# Altium schematic sheet SNC8600.SchDoc: 1234
size A2
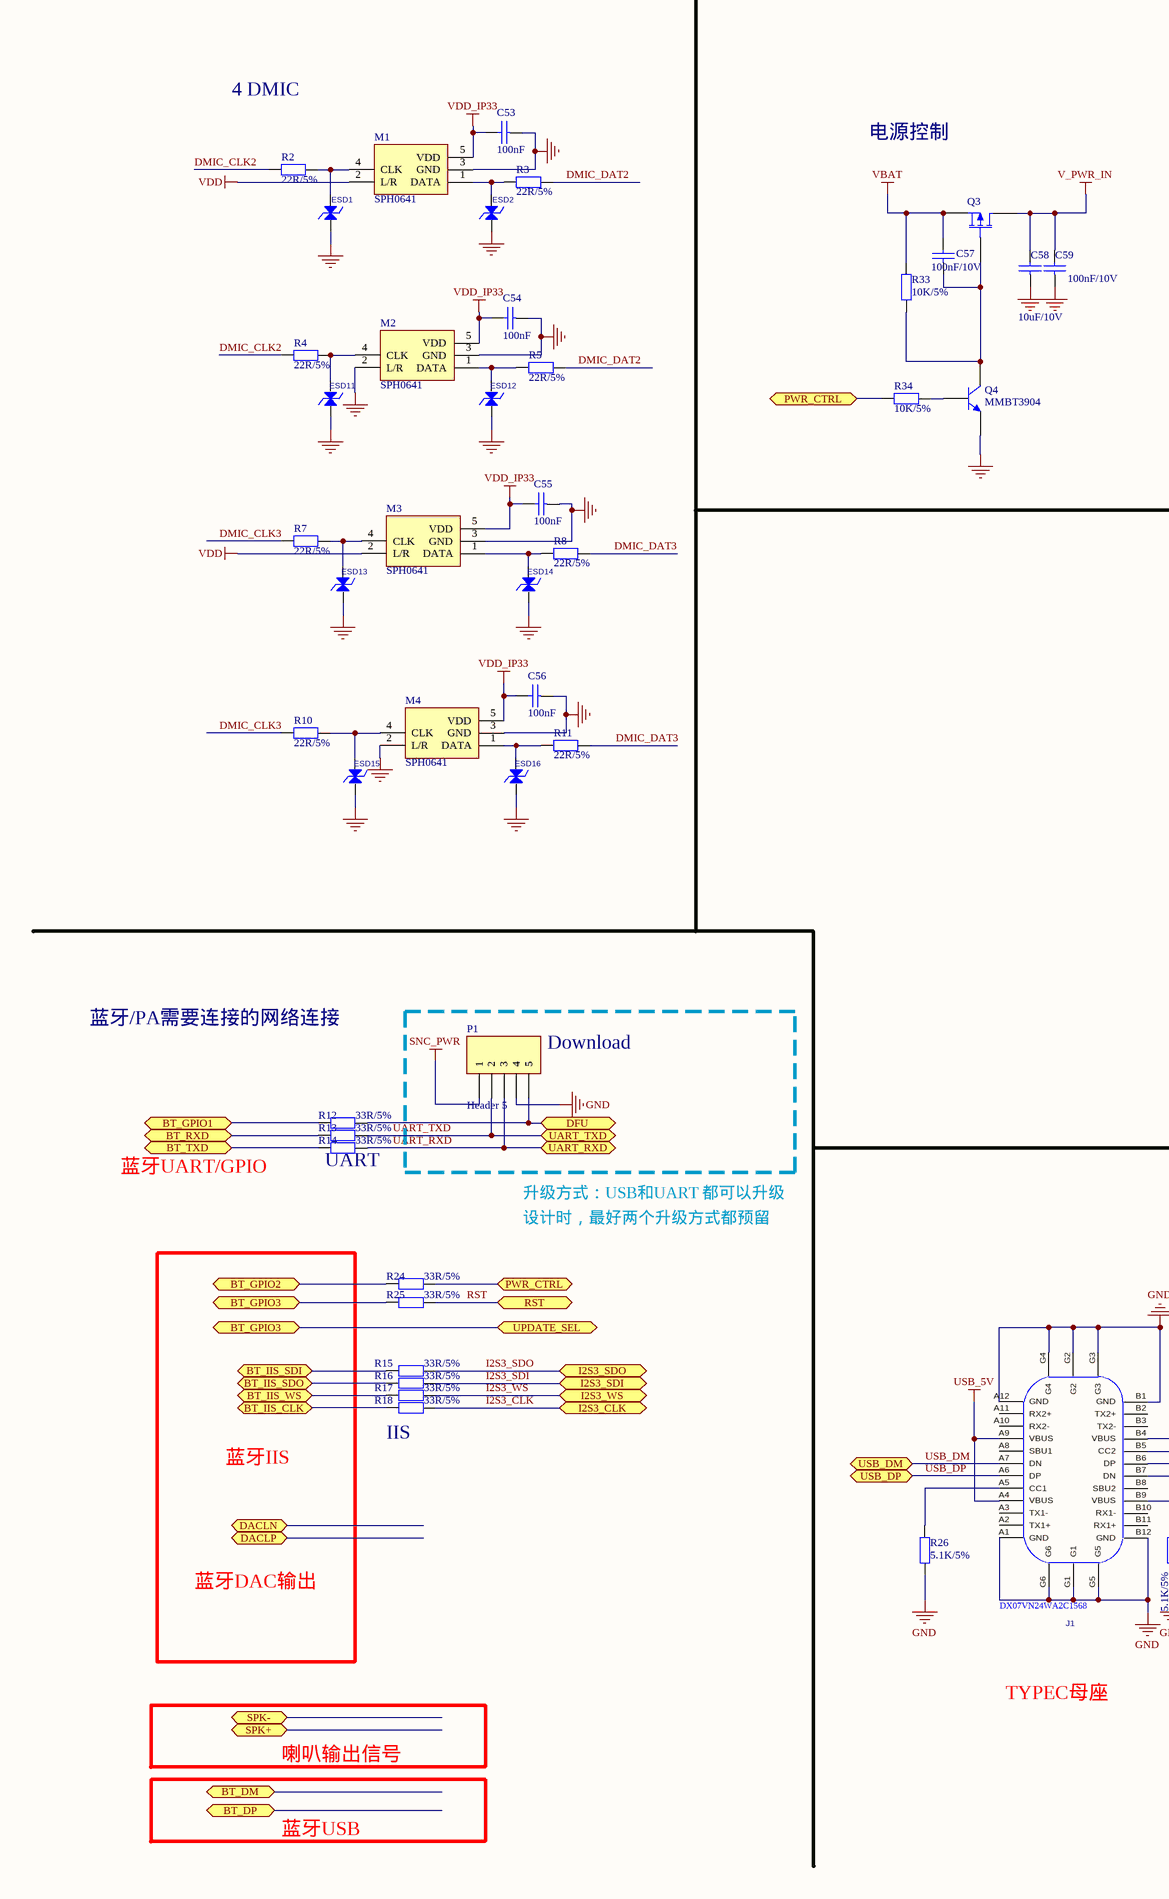
[diagram p0: SNC8600.SchDoc, left]
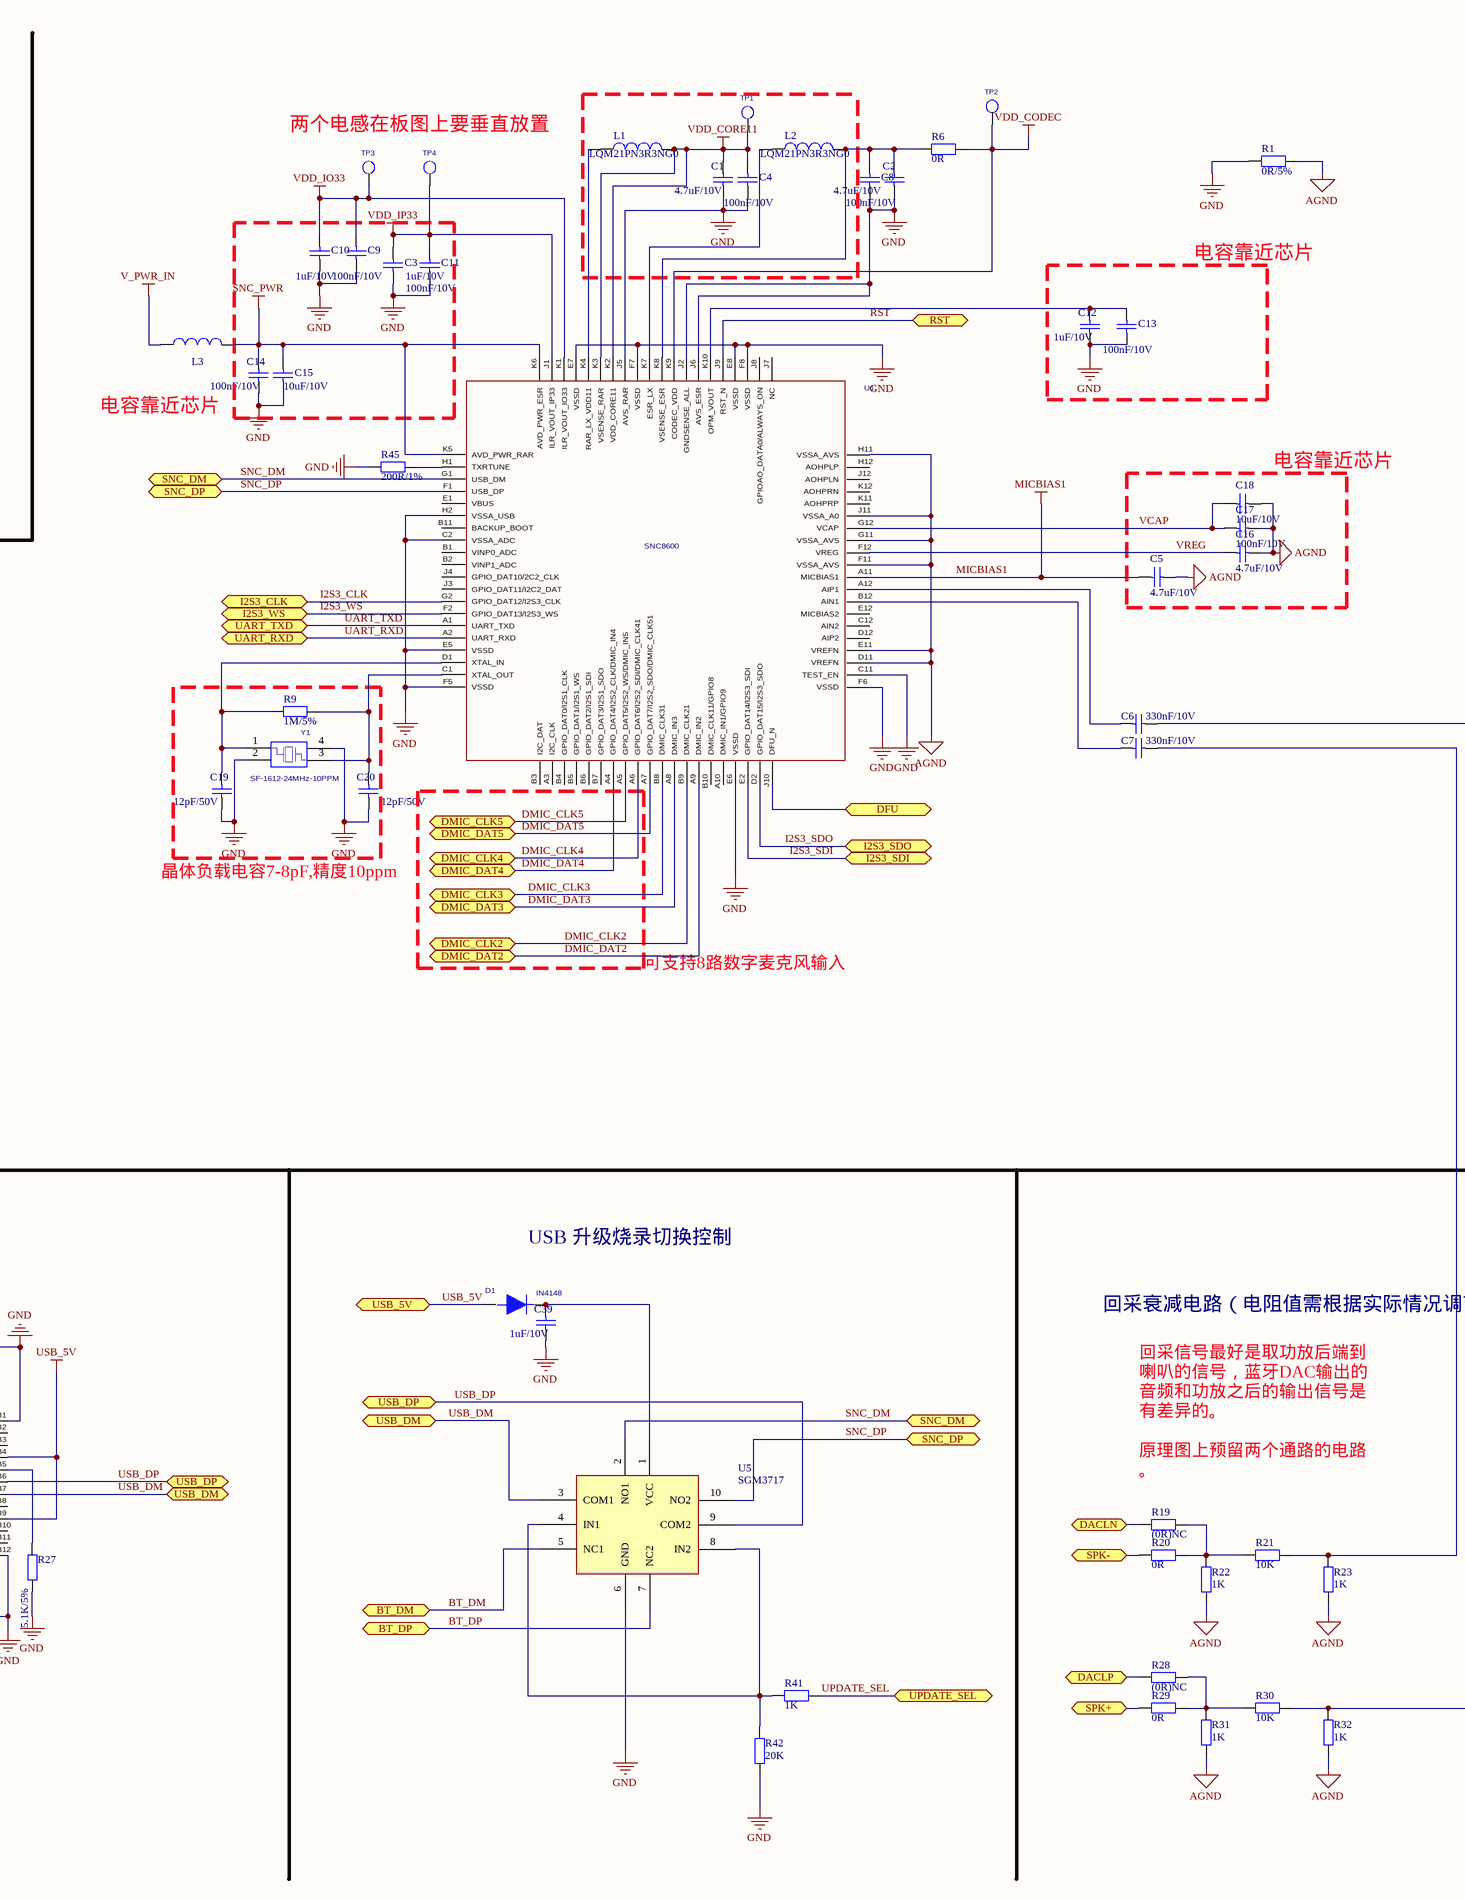
[diagram p1: SNC8600.SchDoc, right]

## Parts
C1  4.7uF/10V  [C0603]
C2  4.7uF/10V  [C0603]
C3  1uF/10V  [C0603]
C4  100nF/10V  [C0603]
C5  4.7uF/10V  [C0603]
C6  330nF/10V  [C0603]
C7  330nF/10V  [C0603]
C8  100nF/10V  [C0603]
C9  100nF/10V  [C0603]
C10  1uF/10V  [C0603]
C11  100nF/10V  [C0603]
C12  1uF/10V  [C0603]
C13  100nF/10V  [C0603]
C14  100nF/10V  [C0603]
C15  10uF/10V  [C0603]
C16  4.7uF/10V  [C0603]
C17  100nF/10V  [C0603]
C18  10uF/10V  [C0603]
C19  12pF/50V  [C0603]
C20  12pF/50V  [C0603]
C39  1uF/10V  [C0603]
C53  100nF  [0201]
C54  100nF  [0201]
C55  100nF  [0201]
C56  100nF  [0201]
C57  100nF/10V  [0201]
C58  10uF/10V  [C0402]
C59  100nF/10V  [0201]
D1  value IN4148  [SMD]  (hidden comment: D-IN4148-SMT)
ESD1  (no value)  [0402 DFN]
ESD2  (no value)  [0402 DFN]
ESD11  (no value)  [0402 DFN]
ESD12  (no value)  [0402 DFN]
ESD13  (no value)  [0402 DFN]
ESD14  (no value)  [0402 DFN]
ESD15  (no value)  [0402 DFN]
ESD16  (no value)  [0402 DFN]
J1  TYPEC  [USB-TYPEC]  (value not drawn)
L1  LQM21PN3R3NG0  [L0805]
L2  LQM21PN3R3NG0  [L0805]
L3  (no value)  [R0402]
M1  SPH0641  [SPH_3526]
M2  SPH0641  [SPH_3526]
M3  SPH0641  [SPH_3526]
M4  SPH0641  [SPH_3526]
P1  Header 5  [HDR1X5]
Q3  (no value)  [SOT23_3407]
Q4  MMBT3904  [SOT23]
R1  0R/5%  [R0603]
R2  22R/5%  [0201]
R3  22R/5%  [0201]
R4  22R/5%  [0201]
R5  22R/5%  [0201]
R6  0R  [R0603]
R7  22R/5%  [0201]
R8  22R/5%  [0201]
R9  1M/5%  [R0603]
R10  22R/5%  [0201]
R11  22R/5%  [0201]
R12  33R/5%  [R0603]
R13  33R/5%  [R0603]
R14  33R/5%  [R0603]
R15  33R/5%  [R0603]
R16  33R/5%  [R0603]
R17  33R/5%  [R0603]
R18  33R/5%  [R0603]
R19  (0R)NC  [R0603]
R20  0R  [R0603]
R21  10K  [R0603]
R22  1K  [R0603]
R23  1K  [R0603]
R24  33R/5%  [R0603]
R25  33R/5%  [R0603]
R26  5.1K/5%  [R0603]
R27  5.1K/5%  [R0603]
R28  (0R)NC  [R0603]
R29  0R  [R0603]
R30  10K  [R0603]
R31  1K  [R0603]
R32  1K  [R0603]
R33  10K/5%  [0201]
R34  10K/5%  [0201]
R41  1K  [R0603]
R42  20K  [R0603]
R45  200R/1%  [R0603]
TP1  TP1  [TP1-1MM]  (value not drawn)
TP2  TP1  [TP1-1MM]  (value not drawn)
TP3  TP1  [TP1-1MM]  (value not drawn)
TP4  TP1  [TP1-1MM]  (value not drawn)
U1  SNC8600  [BGA0405-2]
U5  SGM3717  [UQFN10]
Y1  value SF-1612-24MHz-10PPM  [SF1612]  (hidden comment: SF1612)

## Blocks framed on the sheet
电容靠近芯片: C12 C13
电容靠近芯片: C5 C16-C18
Download: P1

## Ports
BT_DM, BT_DP, BT_GPIO1, BT_GPIO2, BT_GPIO3, BT_IIS_CLK, BT_IIS_SDI, BT_IIS_SDO, BT_IIS_WS, BT_RXD, BT_TXD, DACLN, DACLP, DFU, DMIC_CLK2, DMIC_CLK3, DMIC_CLK4, DMIC_CLK5, DMIC_DAT2, DMIC_DAT3, DMIC_DAT4, DMIC_DAT5, I2S3_CLK, I2S3_SDI, I2S3_SDO, I2S3_WS, PWR_CTRL, RST, SNC_DM, SNC_DP, SPK+, SPK-, UART_RXD, UART_TXD, UPDATE_SEL, USB_5V, USB_DM, USB_DP

## Nets
AGND: C5.1 C16.1 C17.1 C18.1 R1.1 R22.2 R23.2 R31.2 R32.2 U1.D11(VREFN) U1.E11(VREFN) U1.F11(VSSA_AVS) U1.G11(VSSA_AVS) U1.H11(VSSA_AVS) U1.J11(VSSA_A0)
GND: C1.1 C2.1 C3.1 C4.1 C8.1 C9.1 C10.1 C11.1 C12.1 C13.1 C14.1 C15.1 C19.1 C20.1 C39.1 C53.1 C54.1 C55.1 C56.1 C58.1 C59.1 ESD1.2 ESD2.2 ESD11.2 ESD12.2 ESD13.2 ESD14.2 ESD15.2 ESD16.2 J1.A1(GND) J1.A12(GND) J1.B1(GND) J1.B12(GND) J1.G1 J1.G2 J1.G3 J1.G4 J1.G5 J1.G6 M1.3(GND) M2.2(L/R) M2.3(GND) M3.3(GND) M4.2(L/R) M4.3(GND) P1.4 Q4.2(E) R1.2 R26.2 R27.2 R42.2 R45.1 U1.C2(VSSA_ADC) U1.C11(TEST_EN) U1.E5(VSSD) U1.E6(VSSD) U1.E7(VSSD) U1.E8(VSSD) U1.F5(VSSD) U1.F6(VSSD) U1.F7(VSSD) U1.F8(VSSD) U1.H2(VSSA_USB) U1.J2(GNDSENSE_ALL) U1.J5(AVS_RAR) U1.J6(AVS_ESR) U5.6(GND) Y1.2 Y1.4
MICBIAS1: C5.2 U1.A11(MICBIAS1)
SNC_PWR: C14.2 C15.2 L3.2 P1.1 U1.K5(AVD_PWR_RAR) U1.K6(AVD_PWR_ESR)
USB_5V: D1.1 J1.A4(VBUS) J1.A9(VBUS) J1.B4(VBUS) J1.B9(VBUS) ; port USB_5V
V_PWR_IN: C58.2 C59.2 L3.1 Q3.1(D)
VBAT: C57.2 Q3.3(S) R33.1
VDD: M1.2(L/R) M3.2(L/R)
VDD_CODEC: R6.1 TP2.1 U1.K9(CODEC_VDD)
VDD_CORE11: C1.2 C4.2 L1.2 TP1.1 U1.K2(VDD_CORE11) U1.K3(VSENSE_RAR)
VDD_IO33: C9.2 C10.2 TP3.1 U1.K1(ILR_VOUT_IO33)
VDD_IP33: C3.2 C11.2 C53.2 C54.2 C55.2 C56.2 M1.5(VDD) M2.5(VDD) M3.5(VDD) M4.5(VDD) TP4.1 U1.J1(ILR_VOUT_IP33)
BT_DM: U5.5(NC1) ; port BT_DM
BT_DP: U5.7(NC2) ; port BT_DP
BT_GPIO1: R12.1 ; port BT_GPIO1
BT_GPIO2: R24.1 ; port BT_GPIO2
BT_IIS_CLK: R18.1 ; port BT_IIS_CLK
BT_IIS_SDI: R15.1 ; port BT_IIS_SDI
BT_IIS_SDO: R16.1 ; port BT_IIS_SDO
BT_IIS_WS: R17.1 ; port BT_IIS_WS
BT_RXD: R13.1 ; port BT_RXD
BT_TXD: R14.1 ; port BT_TXD
DACLN: R19.2 ; port DACLN
DACLP: R28.2 ; port DACLP
DFU: P1.5 R12.2 U1.J10(DFU_N) ; port DFU
DMIC_CLK2: R2.1 R4.1 U1.B9(DMIC_CLK21) ; port DMIC_CLK2
DMIC_CLK3: R7.1 R10.1 U1.B8(DMIC_CLK31) ; port DMIC_CLK3
DMIC_CLK4: U1.A6(GPIO_DAT6/I2S2_SDI/DMIC_CLK41) ; port DMIC_CLK4
DMIC_CLK5: U1.A5(GPIO_DAT5/I2S2_WS/DMIC_IN5) ; port DMIC_CLK5
DMIC_DAT2: R3.2 R5.2 U1.A9(DMIC_IN2) ; port DMIC_DAT2
DMIC_DAT3: R8.2 R11.2 U1.A8(DMIC_IN3) ; port DMIC_DAT3
DMIC_DAT4: U1.A4(GPIO_DAT4/I2S2_CLK/DMIC_IN4) ; port DMIC_DAT4
DMIC_DAT5: U1.A7(GPIO_DAT7/I2S2_SDO/DMIC_CLK51) ; port DMIC_DAT5
I2S3_CLK: R18.2 U1.G2(GPIO_DAT12/I2S3_CLK) ; port I2S3_CLK
I2S3_SDI: R16.2 U1.E2(GPIO_DAT14/I2S3_SDI) ; port I2S3_SDI
I2S3_SDO: R15.2 U1.D2(GPIO_DAT15/I2S3_SDO) ; port I2S3_SDO
I2S3_WS: R17.2 U1.F2(GPIO_DAT13/I2S3_WS) ; port I2S3_WS
PWR_CTRL: R24.2 R34.1 ; port PWR_CTRL
RST: R25.2 U1.J9(RST_N) ; port RST
SNC_DM: U1.G1(USB_DM) U5.2(NO1) ; port SNC_DM
SNC_DP: U1.F1(USB_DP) U5.10(NO2) ; port SNC_DP
SPK+: R29.2 ; port SPK+
SPK-: R20.2 ; port SPK-
UART_RXD: P1.3 R14.2 U1.A2(UART_RXD) ; port UART_RXD
UART_TXD: P1.2 R13.2 U1.A1(UART_TXD) ; port UART_TXD
UPDATE_SEL: R25.1 R41.1 ; port BT_GPIO3, port UPDATE_SEL
USB_DM: J1.A7(DN) J1.B7(DN) U5.3(COM1) ; port USB_DM
USB_DP: J1.A6(DP) J1.B6(DP) U5.9(COM2) ; port USB_DP
VCAP: C17.2 C18.2 U1.G12(VCAP)
VREG: C16.2 U1.F12(VREG)
NetC2_2: C2.2 C8.2 L2.2 R6.2 U1.K8(VSENSE_ESR)
NetC6_1: C6.1 R30.1 R32.1
NetC6_2: C6.2 U1.A12(AIP1)
NetC7_1: C7.1 R21.1 R23.1
NetC7_2: C7.2 U1.B12(AIN1)
NetC12_2: C12.2 C13.2 U1.K10(OPM_VOUT)
NetC19_2: C19.2 R9.2 U1.D1(XTAL_IN) Y1.1
NetC20_2: C20.2 R9.1 U1.C1(XTAL_OUT) Y1.3
NetC39_2: C39.2 D1.2 U5.1(VCC)
NetC57_1: C57.1 Q3.2(G) Q4.3(C) R33.2
NetESD1_1: ESD1.1 M1.4(CLK) R2.2
NetESD2_1: ESD2.1 M1.1(DATA) R3.1
NetESD11_1: ESD11.1 M2.4(CLK) R4.2
NetESD12_1: ESD12.1 M2.1(DATA) R5.1
NetESD13_1: ESD13.1 M3.4(CLK) R7.2
NetESD14_1: ESD14.1 M3.1(DATA) R8.1
NetESD15_1: ESD15.1 M4.4(CLK) R10.2
NetESD16_1: ESD16.1 M4.1(DATA) R11.1
NetJ1_A5: J1.A5(CC1) R26.1
NetJ1_B5: J1.B5(CC2) R27.1
NetL1_1: L1.1 U1.K4(RAR_LX_VDD11)
NetL2_1: L2.1 U1.K7(ESR_LX)
NetQ4_1: Q4.1(B) R34.2
NetR19_1: R19.1 R20.1 R21.2 R22.1
NetR28_1: R28.1 R29.1 R30.2 R31.1
NetR41_2: R41.2 R42.1 U5.4(IN1) U5.8(IN2)
NetR45_2: R45.2 U1.H1(TXRTUNE)

Not connected (* = marked no-connect by the designer): J1 A2(TX1+) A3(TX1-) A8(SBU1) A10(RX2-) A11(RX2+) B2(TX2+) B3(TX2-) B8(SBU2) B10(RX1-) B11(RX1+); U1 A3(I2C_CLK) A10(DMIC_IN1/GPIO9) B1(VINP0_ADC) B2(VINP1_ADC) B3(I2C_DAT) B4(GPIO_DAT0/I2S1_CLK) B5(GPIO_DAT1/I2S1_WS) B6(GPIO_DAT2/I2S1_SDI) B7(GPIO_DAT3/I2S1_SDO) B10(DMIC_CLK11/GPIO8) B11(BACKUP_BOOT) C12(AIN2) D12(AIP2) E1(VBUS) E12(MICBIAS2) H12(AOHPLP) J3(GPIO_DAT11/I2C2_DAT) J4(GPIO_DAT10/2C2_CLK) J7(NC) J8(GPIOAO_DATA0/ALWAYS_ON) J12(AOHPLN) K11(AOHPRP) K12(AOHPRN)

## Notes on the sheet
- 4 DMIC
- 两个电感在板图上要垂直放置
- 电源控制
- 电容靠近芯片
- 晶体负载电容7-8pF,精度10ppm
- 可支持8路数字麦克风输入
- 蓝牙/PA需要连接的网络连接
- 蓝牙UART/GPIO
- (near R14) UART
- 升级方式：USB和UART 都可以升级
- 设计时，最好两个升级方式都预留
- USB 升级烧录切换控制
- 回采衰减电路（电阻值需根据实际情况调节）
- 蓝牙IIS
- (near R18) IIS
- (near R19) 回采信号最好是取功放后端到喇叭的信号，蓝牙DAC输出的音频和功放之后的输出信号是有差异的。
  原理图上预留两个通路的电路。
- 蓝牙DAC输出
- (near J1) DX07VN24WA2C1568
- TYPEC母座
- 喇叭输出信号
- 蓝牙USB

## Library data of the parts
C1-C20 C39 = Cap Semi: Capacitor (Semiconductor SIM Model); Value: 100pF; Published: 8-Jun-2000; LatestRevisionDate: 29-May-2009; LatestRevisionNote: IPC-7351 Footprint Added.; PackageReference: C1206; Publisher: Altium Limited; PackageDescription: Chip Capacitor
C53-C56 = CAP-0201: Capacitor
C57 = CAP: Capacitor; Comment_1: 30pF
C58 C59 = 普通电容: Capacitor
ESD1 ESD2 ESD11-ESD16 = ESD: Sim.Analog.Order: Model$; PCB DECAL: 0402
J1 = TYPEC: PCB DECAL: DX07VN24WA2
L1-L3 = Inductor: Code_IEC: 1005; Value: 10mH; Published: 8-Jun-2000; LatestRevisionDate: 29-May-2009; LatestRevisionNote: IPC-7351 Footprint Added.; PackageReference: 0402-A; Publisher: Altium Limited; PackageDescription: Chip Inductor; Code_JEITA: 0402
M1-M4 = SPH0641: MEMS MICPHONE; Published: 8-Jun-2000; LatestRevisionDate: 29-May-2009; LatestRevisionNote: IPC-7351 Footprint Added.; PackageVersion: Mar-2002; PackageReference: SOT403-1; Publisher: Altium Limited; PackageDescription: 16-Pin Thin Small Outline Package 0.65 mm Pitch; Code_JEDEC: MO-153
P1 = Header 5: Header, 5-Pin; LatestRevisionDate: 17-Jul-2002; LatestRevisionNote: Re-released for DXP Platform.; Publisher: Altium Limited
Q3 = MOSFET-P: P-Channel MOSFET; Published: 8-Jun-2000; LatestRevisionDate: 17-Jul-2002; LatestRevisionNote: Re-released for DXP Platform.; PackageVersion: 1995/1996; PackageReference: E3; Publisher: Altium Limited; PackageDescription: TO, Flat Index; 3 In-Line, Axial Leads; Body Dia. 4.6mm; Lead Dia. 0.5 mm (max)
Q4 = 2N3904: NPN General Purpose Amplifier; Published: 8-Jun-2000; LatestRevisionDate: 15-Jan-2003; LatestRevisionNote: PCB Footprint 'BCY-W3/D4.7' replaced; DatasheetVersion: 1997; PackageVersion: Sep-1998; PackageReference: TO-92A; Publisher: Altium Limited; PackageDescription: TO, Flat Index; 3 In-Line, Axial Leads; Body Dia. 4.5mm; Leads 0.51 x 0.48 mm (max); ComponentLink1Description: Manufacturer Link; ComponentLink1URL: http://www.fairchildsemi.com/; ComponentLink2Description: Datasheet; ComponentLink2URL: http://www.fairchildsemi.com/ds/2N%2F2N3904.pdf
R1-R5 R7-R34 R41 R42 R45 = Res2: Resistor; Value: 1M; Published: 8-Jun-2000; LatestRevisionDate: 17-Jul-2002; LatestRevisionNote: Re-released for DXP Platform.; PackageReference: AXIAL-0.4; Publisher: Altium Limited; PackageDescription: Axial Device, Thru-Hole; 2 Leads; 0.4 in Pin Spacing
R6 = Res2: Resistor; Value: 1K; Published: 8-Jun-2000; LatestRevisionDate: 17-Jul-2002; LatestRevisionNote: Re-released for DXP Platform.; PackageReference: AXIAL-0.4; Publisher: Altium Limited; PackageDescription: Axial Device, Thru-Hole; 2 Leads; 0.4 in Pin Spacing
U1 = BGA_BCHIP-ES2: Value: BCHIP; PCB DECAL: BGA0405-2
U5 = NLAS2750
D1 = D-IN4148-SMT: PCB DECAL: SMD
TP1-TP4 = TP1: PCB DECAL: TP1
Y1 = SF1612: PCB DECAL: SF1612